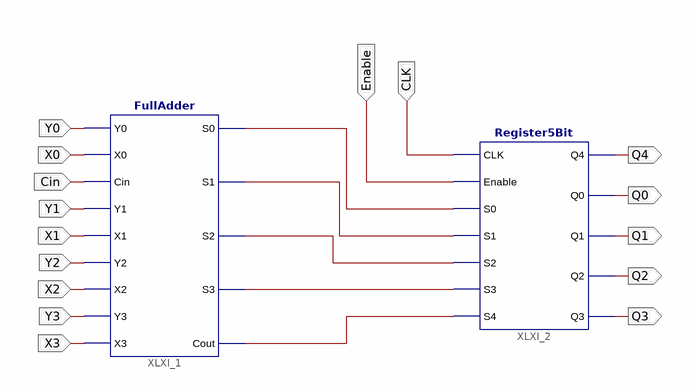
[diagram p0: schematic sheet 1]
// Xilinx ISE schematic FA4Bit_5BitReg.sch (spartan3e) as structural Verilog: 2 symbols, 16 ports
module FA4Bit_5BitReg (
  input  CLK,
  input  Enable,
  input  Y0,
  input  X0,
  input  Cin,
  input  Y1,
  input  X1,
  input  Y2,
  input  X2,
  input  Y3,
  input  X3,
  output Q4,
  output Q0,
  output Q1,
  output Q2,
  output Q3
);

  wire XLXN_1, XLXN_2, XLXN_3, XLXN_4, XLXN_5;

  FullAdder XLXI_1 (
    .Y0(Y0), .X0(X0), .Cin(Cin), .Y1(Y1), .X1(X1), .Y2(Y2), .X2(X2), .Y3(Y3), .X3(X3), .S0(XLXN_1),
    .S1(XLXN_2), .S2(XLXN_3), .S3(XLXN_4), .Cout(XLXN_5));
  Register5Bit XLXI_2 (
    .CLK(CLK), .Enable(Enable), .S0(XLXN_1), .S1(XLXN_2), .S2(XLXN_3), .S3(XLXN_4), .S4(XLXN_5), .Q4(Q4),
    .Q0(Q0), .Q1(Q1), .Q2(Q2), .Q3(Q3));
endmodule
